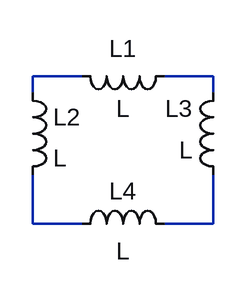
[diagram p0: schematic one_rotated_inductor.asc]
one_rotated_inductor.asc, the LTspice schematic file:
Version 4
SHEET 1 880 680
WIRE 128 128 80 128
WIRE 256 128 208 128
WIRE 80 144 80 128
WIRE 256 144 256 128
WIRE 80 272 80 224
WIRE 128 272 80 272
WIRE 256 272 256 224
WIRE 256 272 208 272
SYMBOL ind 224 112 R90
WINDOW 0 5 56 VBottom 2
WINDOW 3 32 56 VTop 2
SYMATTR InstName L1
SYMBOL ind 64 128 R0
SYMATTR InstName L2
SYMBOL ind 272 240 R180
WINDOW 0 36 80 Left 2
WINDOW 3 36 40 Left 2
SYMATTR InstName L3
SYMBOL ind 112 288 R270
WINDOW 0 32 56 VTop 2
WINDOW 3 5 56 VBottom 2
SYMATTR InstName L4

The netlist it stands for:
* one_rotated_inductor.asc
L1 N002 N001 L
L2 N001 N003 L
L3 N004 N002 L
L4 N003 N004 L
.backanno
.end